# EasyEDA Pro project 4Layer_Artix7_DDR3_Core_Board.epro, board PCB1
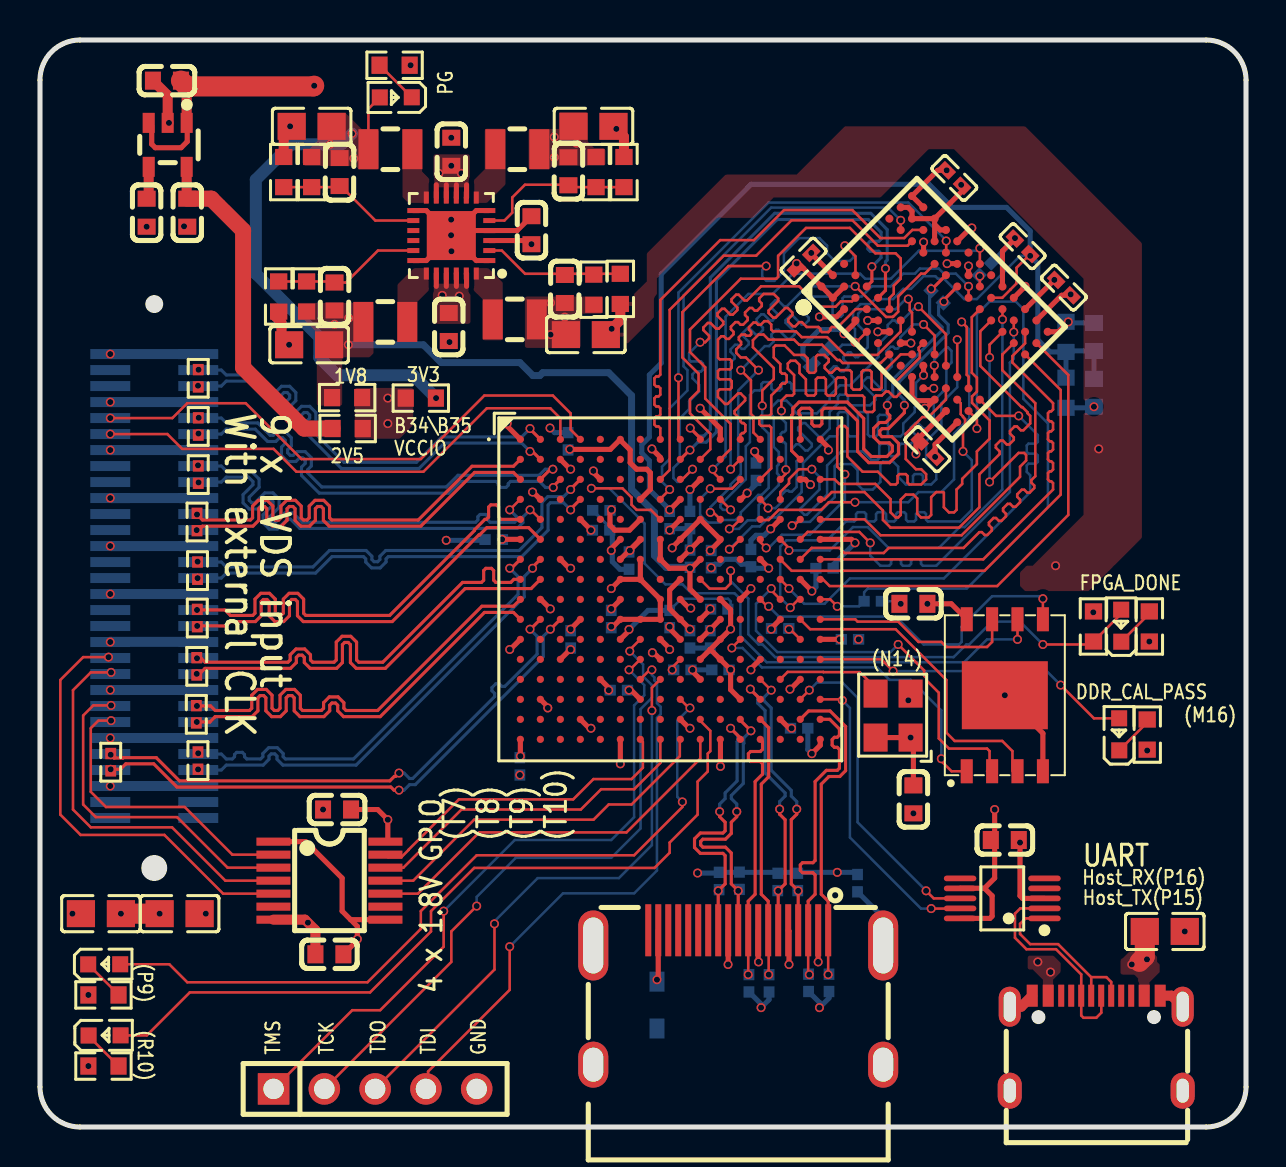
[diagram p2: board, top side]
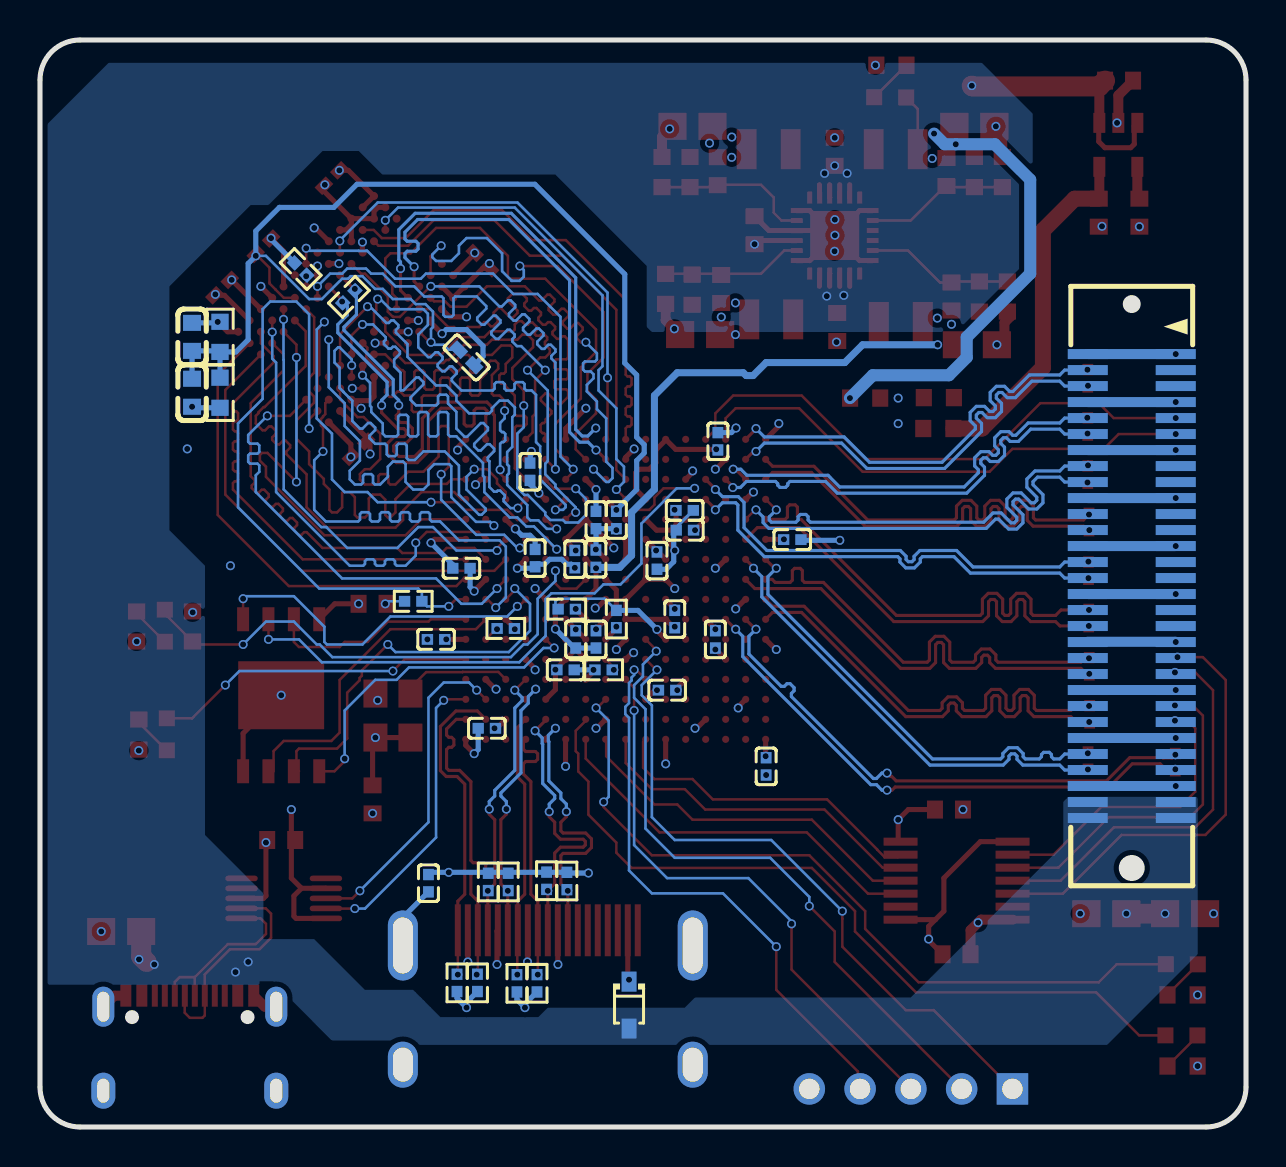
[diagram p3: board, bottom side, seen from below]

Outline 60.33 x 54.36 mm; copper layers: Top Layer, Inner1, Inner2, Bottom Layer. Coordinates in mm from the lower left corner of the outline.
Outline path: 0,52.36 0,2 arc(0.59,0.59) 2,0 58.33,0 arc(59.74,0.59) 60.33,2 60.33,52.36 arc(59.74,53.77) 58.33,54.36 2,54.36 arc(0.59,53.77) 0,52.36
Stack: Top Layer 0.035mm 外层铜厚1oz / Dielectric1 0.2104mm 7628 RC49% 8.6mil / Inner1 0.0152mm 内层铜厚 / Dielectric2 1.065mm 1.1mm H/HOZ Copper / Inner2 0.0152mm 内层铜厚 / Dielectric3 0.2104mm 7628 RC49% 8.6mil / Bottom Layer 0.035mm 外层铜厚1oz

## Design rules (mm)
net DDR_DQ2: DDR_DQ
net DDR_DQ0: DDR_DQ
net DDR_DM: DDR_DQ
net DDR_DQ3: DDR_DQ
net DDR_DQS_P: DDR_DQ, DP1
net DDR_DQ1: DDR_DQ
net DDR_DQS_N: DDR_DQ, DP1
net DDR_DQ4: DDR_DQ
net DDR_DQ5: DDR_DQ
net DDR_DQ7: DDR_DQ
net DDR_DQ6: DDR_DQ
net DDR_A8: DDR_CA
net DDR_A14: DDR_CA
net DDR_A13: DDR_CA
net DDR_A6: DDR_CA
net DDR_A11: DDR_CA
net DDR_A9: DDR_CA
net DDR_A7: DDR_CA
net DDR_A4: DDR_CA
net DDR_A1: DDR_CA
net DDR_A2: DDR_CA
net DDR_A5: DDR_CA
net DDR_BA1: DDR_CA
net DDR_A12: DDR_CA
net DDR_A0: DDR_CA
net DDR_A3: DDR_CA
net DDR_A15: DDR_CA
net DDR_BA2: DDR_CA
net DDR_BA0: DDR_CA
net DDR_A10: DDR_CA
net DDR_WE_N: DDR_CA
net DDR_CS_N: DDR_CA
net DDR_CKE: DDR_CA
net DDR_CK_N: DDR_CA, DP2
net DDR_CAS_N: DDR_CA
net DDR_ODT: DDR_CA
net DDR_CK_P: DDR_CA, DP2
net DDR_RAS_N: DDR_CA
net TMDS_D2_P: DP6
net TMDS_D2_N: DP6
net TMDS_D1_P: DP5
net TMDS_D1_N: DP5
net TMDS_D0_P: DP4
net TMDS_D0_N: DP4
net TMDS_CK_P: DP3
net TMDS_CK_N: DP3
net LVDS_CLK_N: LVDS, DP7
net LVDS_CLK_P: LVDS, DP7
net LVDS_D3_P: LVDS, DP8
net LVDS_D3_N: LVDS, DP8
net LVDS_D0_P: LVDS, DP9
net LVDS_D0_N: LVDS, DP9
net LVDS_D1_P: LVDS, DP10
net LVDS_D1_N: LVDS, DP10
net LVDS_D2_P: LVDS, DP11
net LVDS_D2_N: LVDS, DP11
net LVDS_D7_P: LVDS, DP13
net LVDS_D7_N: LVDS, DP13
net LVDS_D6_P: LVDS, DP14
net LVDS_D6_N: LVDS, DP14
net LVDS_D5_P: LVDS, DP15
net LVDS_D5_N: LVDS, DP15
net LVDS_D4_P: LVDS, DP12
net LVDS_D4_N: LVDS, DP12
net LVDS_D8_P: LVDS, DP16
net LVDS_D8_N: LVDS, DP16
template: 自定义配置
spacing copperThickness1oz (default): track to track 0.127, other pairs 0.127 to 0.3
spacing copperThickness2oz: track to track 0.203, other pairs 0.152 to 0.3
spacing copperThicknessInner0.5oz: track to track 0.089, other pairs 0.152 to 0.3
track width copperThickness1oz (default): min 0.102, default 0.127, max 2.54
track width copperThickness2oz: min 0.203, default 0.254, max 2.54
track width copperThickness0.5oz: min 0.089, default 0.254, max 2.54
differential pair differentialPair (default): width min 0.127, default 0.156, max 2.54; gap min 0.152, default 0.152
via viaSize (default): diameter min 0.3, default 0.45, max 10; hole min 0.2, default 0.305, max 6.3
net GND uses copperRegionGND

## Placement (name value [footprint] x y rotation side)
C1  100nF  [C0402]  44.39 33.89 135 top
C3  100nF  [C0402]  45.74 47.45 135 top
C4  100nF  [C0402]  38.19 43.32 45 top
C5  100nF  [C0402]  51.21 41.97 315 top
C7  100nF  [C0402]  49.15 44.04 315 top
C8  100nF  [C0402]  38.99 38.48 45 bottom
C9  470nF  [C0402-S]  39.24 27.94 180 bottom
C10  470nF  [C0402-S]  35.56 28.45 90 bottom
C11  470nF  [C0402-S]  31.5 30.35 90 bottom
C12  470nF  [C0402-S]  35.81 32.77 90 bottom
C13  470nF  [C0402-S]  32.51 30.35 90 bottom
C54  220pF  [C0603]  14.99 47.75 90 top
C55  220pF  [C0603]  26.43 47.79 270 top
C56  220pF  [C0603]  26.25 41.91 90 top
C57  220pF  [C0603]  14.73 41.53 270 top
C59  470nF  [C0402-S]  28.58 25.4 90 bottom
C60  470nF  [C0402-S]  29.46 28.32 90 bottom
C61  470nF  [C0402-S]  32.51 24.38 90 bottom
C62  470nF  [C0402-S]  33.57 28.4 90 bottom
C63  470nF  [C0402-S]  33.53 24.38 90 bottom
C64  470nF  [C0402-S]  32.52 28.42 270 bottom
C67  470nF  [C0402-S]  40.51 24.38 180 bottom
C68  470nF  [C0402-S]  37.97 19.94 180 bottom
C69  470nF  [C0402-S]  28.96 21.84 0 bottom
C70  470nF  [C0402-S]  34.04 22.86 180 bottom
C72  470nF  [C0402-S]  24 18.03 90 bottom
C74  470nF  [C0402-S]  26.54 24.38 270 bottom
C75  470nF  [C0402-S]  28.07 29.84 180 bottom
C76  470nF  [C0402-S]  26.42 34.29 270 bottom
C77  22uF  [C0805]  13.59 50.04 0 top
C78  22uF  [C0805]  27.69 50.04 0 top
C79  22uF  [C0805]  13.46 39.12 0 top
C80  22uF  [C0805]  27.31 39.62 0 top
C82  100nF  [C0603]  43.69 16.38 90 top
C83  100nF  [C0603]  43.69 26.16 0 top
C84  10uF  [C0603]  20.57 48.77 270 top
C85  10uF  [C0603]  20.45 40 90 top
C86  10uF  [C0603]  24.58 44.84 270 top
C87  470nF  [C0402-S]  28.08 30.84 0 bottom
C88  100nF  [C0603]  48.26 14.35 180 top
C89  10uF  [C0603]  5.33 45.72 90 top
C90  10uF  [C0603]  7.37 45.72 90 top
C91  10uF  [C0603]  6.35 52.32 0 top
C92  100nF  [C0603]  52.72 39.51 270 bottom
C93  100nF  [C0603]  52.72 36.72 270 bottom
C94  100nF  [C0603]  14.48 8.64 0 top
C95  100nF  [C0603]  14.86 15.88 0 top
C96  470nF  [C0402-S]  22.7 29.37 0 bottom
C97  22uF  [C0805]  3.05 10.67 0 top
C98  22uF  [C0805]  56.26 9.78 180 top
C99  22uF  [C0805]  6.98 10.67 180 top
C100  470nF  [C0402-S]  40.89 12.19 90 bottom
CN1  X0802WVS-60AS-LPV01  [CONN-SMD_60P-P0.80_XKB_X0802WVS-60ADS-LPV01]  5.72 27.05 270 bottom
D1  1N5819WS  [SOD-323_L1.8-W1.3-LS2.5-RD]  30.86 6.1 270 bottom
H1  -  [HDR-TH_5P-P2.54-V-F]  16.76 1.91 0 top
L1  1.5uH  [IND-SMD_L2.5-W2.0_YXMBL252010P]  17.53 48.89 180 top
L2  1.5uH  [IND-SMD_L2.5-W2.0_YXMBL252010P]  23.88 48.89 0 top
L3  1.5uH  [IND-SMD_L2.5-W2.0_YXMBL252010P]  23.75 40.39 180 top
L4  1.5uH  [IND-SMD_L2.5-W2.0_YXMBL252010P]  17.27 40.26 0 top
LED1  -  [LED_0603]  54.08 25.12 90 top
LED2  -  [LED_0603]  53.97 19.69 90 top
LED3  -  [LED_0603]  17.75 51.48 180 top
LED4  -  [LED_0603]  3.26 8.14 0 top
LED5  -  [LED_0603]  3.28 4.59 0 top
R1  240  [R0402]  47.28 42.9 225 bottom
R2  100  [R0402]  44.88 41.52 315 bottom
R3  NAN  [R0603]  27.81 47.75 270 top
R4  NAN  [R0603]  29.21 47.75 270 top
R5  NAN  [R0603]  27.7 41.87 90 top
R6  NAN  [R0603]  29.03 41.91 270 top
R7  NAN  [R0603]  13.34 41.53 270 top
R8  NAN  [R0603]  11.94 41.53 270 top
R9  NAN  [R0603]  13.59 47.75 90 top
R10  NAN  [R0603]  12.19 47.75 90 top
R11  0R  [R0603]  15.36 36.47 180 top
R12  NAN  [R0603]  15.39 34.93 180 top
R13  4.7K  [R0402]  33.98 25.89 0 bottom
R14  1K  [R0402]  32.13 22.86 0 bottom
R15  4.7K  [R0402]  31.5 25.4 90 bottom
R16  1K  [R0402]  37.02 24.93 0 bottom
R20  1K  [R0603]  52.69 25.03 90 top
R21  1K  [R0603]  55.49 25.03 90 top
R22  1K  [R0603]  55.38 19.62 90 top
R23  50R  [R0402]  37.9 12.25 270 bottom
R24  50R  [R0402]  36.91 12.25 270 bottom
R25  50R  [R0402]  34.99 12.31 270 bottom
R26  50R  [R0402]  33.97 12.3 270 bottom
R27  50R  [R0402]  39.47 7.21 90 bottom
R28  50R  [R0402]  38.44 7.21 90 bottom
R29  50R  [R0402]  36.47 7.19 90 bottom
R30  50R  [R0402]  35.46 7.19 90 bottom
R31  100R  [R0402]  3.54 18.24 270 top
R32  100R  [R0402]  7.82 20.64 90 top
R33  100R  [R0402]  7.84 23.04 90 top
R34  100R  [R0402]  7.9 18.32 90 top
R35  100R  [R0402]  7.87 25.45 90 top
R36  100R  [R0402]  7.88 27.82 90 top
R37  100R  [R0402]  7.92 32.62 90 top
R38  100R  [R0402]  7.85 30.25 90 top
R39  100R  [R0402]  7.92 37.44 90 top
R40  100R  [R0402]  7.92 35.03 90 top
R41  1K  [R0603]  51.32 36.72 270 bottom
R42  1K  [R0603]  51.32 39.51 270 bottom
R43  4.7K  [R0603]  17.74 53.09 180 top
R44  4.7K  [R0603]  3.17 6.6 0 top
R45  4.7K  [R0603]  3.17 3.05 0 top
R46  NAN  [R0603]  19.05 36.45 0 top
R47  4.7K  [R0402]  41.66 26.29 180 bottom
U1  XC7A35T-2FTG256I  [FTBGA-256_L17.0-W17.0-R16-C16-P1.00-TL]  31.53 26.89 0 top
U2  MT41K512M8DA-107 AIT:P  [FBGA-78_L10.5-W8.0-R13-C6-P0.80-TL]  44.75 40.9 45 top
U4  EA3059  [VQFN-24_L4.0-W4.0-P0.50-TL-EP2.5]  20.57 44.58 180 top
U5  W25Q128JVEIQ  [WSON-8_L6.0-W8.0-P1.27-BL-EP]  48.26 21.59 0 top
U6  CH340E  [MSOP-10_L3.0-W3.0-P0.50-LS5.0-BL]  48.13 11.43 90 top
U7  SPX3819M5-L-2-5/TR  [SOT-23-5_L2.9-W1.6-P0.95-LS2.8-BR]  6.39 49.11 90 top
U8  TXS0104EPWR  [TSSOP-14_L5.0-W4.4-P0.65-LS6.4-BL]  14.48 12.32 270 top
USB1  HDMI-001S  [HDMI-SMD_HDMI-001S]  34.93 6.48 0 top
USB2  TYPE-C 16PIN 2MD(073)  [USB-C-SMD_TYPE-C-6PIN-2MD-073]  52.83 4.19 0 top
X1  50MHz  [OSC-SMD_4P-L3.2-W2.5-BL]  42.67 20.57 90 top

## Footprints (pads in the part's own frame, mm; a bottom-side part is the same pattern mirrored in y, then rotated)
C0402
  rect 0.79x0.54 smd: 1(-0.545,0) 2(0.545,0)
C0402-S
  rect 0.566x0.54 smd: 1(-0.433,0) 2(0.433,0)
C0603
  rect 0.8x0.9 smd: 1(-0.7,0) 2(0.7,0)
C0805
  rect 1.41x1.35 smd: 1(-1,0) 2(1,0)
CONN-SMD_60P-P0.80_XKB_X0802WVS-60ADS-LPV01
  rect 0.5x2 smd: 1(-11.6,2.2) 2(-11.6,-2.2) 3(-10.8,2.2) 4(-10.8,-2.2) 5(-10,2.2) 6(-10,-2.2) 7(-9.2,2.2) 8(-9.2,-2.2) 9(-8.4,2.2) 10(-8.4,-2.2) 11(-7.6,2.2) 12(-7.6,-2.2) 13(-6.8,2.2) 14(-6.8,-2.2) 15(-6,2.2) 16(-6,-2.2) 17(-5.2,2.2) 18(-5.2,-2.2) 19(-4.4,2.2) 20(-4.4,-2.2) 21(-3.6,2.2) 22(-3.6,-2.2) 23(-2.8,2.2) 24(-2.8,-2.2) 25(-2,2.2) 26(-2,-2.2) 27(-1.2,2.2) 28(-1.2,-2.2) 29(-0.4,2.2) 30(-0.4,-2.2) 31(0.4,2.2) 32(0.4,-2.2) 33(1.2,2.2) 34(1.2,-2.2) 35(2,2.2) 36(2,-2.2) 37(2.8,2.2) 38(2.8,-2.2) 39(3.6,2.2) 40(3.6,-2.2) 41(4.4,2.2) 42(4.4,-2.2) 43(5.2,2.2) 44(5.2,-2.2) 45(6,2.2) 46(6,-2.2) 47(6.8,2.2) 48(6.8,-2.2) 49(7.6,2.2) 50(7.6,-2.2) 51(8.4,2.2) 52(8.4,-2.2) 53(9.2,2.2) 54(9.2,-2.2) 55(10,2.2) 56(10,-2.2) 57(10.8,2.2) 58(10.8,-2.2) 59(11.6,2.2) 60(11.6,-2.2)
FBGA-78_L10.5-W8.0-R13-C6-P0.80-TL
  round 0.4 smd: A1(-3.2,4.8) A2(-2.4,4.8) A3(-1.6,4.8) A7(1.6,4.8) A8(2.4,4.8) A9(3.2,4.8) B1(-3.2,4) B2(-2.4,4) B3(-1.6,4) B7(1.6,4) B8(2.4,4) B9(3.2,4) C1(-3.2,3.2) C2(-2.4,3.2) C3(-1.6,3.2) C7(1.6,3.2) C8(2.4,3.2) C9(3.2,3.2) D1(-3.2,2.4) D2(-2.4,2.4) D3(-1.6,2.4) D7(1.6,2.4) D8(2.4,2.4) D9(3.2,2.4) E1(-3.2,1.6) E2(-2.4,1.6) E3(-1.6,1.6) E7(1.6,1.6) E8(2.4,1.6) E9(3.2,1.6) F1(-3.2,0.8) F2(-2.4,0.8) F3(-1.6,0.8) F7(1.6,0.8) F8(2.4,0.8) F9(3.2,0.8) G1(-3.2,0) G2(-2.4,0) G3(-1.6,0) G7(1.6,0) G8(2.4,0) G9(3.2,0) H1(-3.2,-0.8) H2(-2.4,-0.8) H3(-1.6,-0.8) H7(1.6,-0.8) H8(2.4,-0.8) H9(3.2,-0.8) J1(-3.2,-1.6) J2(-2.4,-1.6) J3(-1.6,-1.6) J7(1.6,-1.6) J8(2.4,-1.6) J9(3.2,-1.6) K1(-3.2,-2.4) K2(-2.4,-2.4) K3(-1.6,-2.4) K7(1.6,-2.4) K8(2.4,-2.4) K9(3.2,-2.4) L1(-3.2,-3.2) L2(-2.4,-3.2) L3(-1.6,-3.2) L7(1.6,-3.2) L8(2.4,-3.2) L9(3.2,-3.2) M1(-3.2,-4) M2(-2.4,-4) M3(-1.6,-4) M7(1.6,-4) M8(2.4,-4) M9(3.2,-4) N1(-3.2,-4.8) N2(-2.4,-4.8) N3(-1.6,-4.8) N7(1.6,-4.8) N8(2.4,-4.8) N9(3.2,-4.8)
FTBGA-256_L17.0-W17.0-R16-C16-P1.00-TL
  round 0.36 smd: A1(-7.5,7.5) A2(-6.5,7.5) A3(-5.5,7.5) A4(-4.5,7.5) A5(-3.5,7.5) A6(-2.5,7.5) A7(-1.5,7.5) A8(-0.5,7.5) A9(0.5,7.5) A10(1.5,7.5) A11(2.5,7.5) A12(3.5,7.5) A13(4.5,7.5) A14(5.5,7.5) A15(6.5,7.5) A16(7.5,7.5) B1(-7.5,6.5) B2(-6.5,6.5) B3(-5.5,6.5) B4(-4.5,6.5) B5(-3.5,6.5) B6(-2.5,6.5) B7(-1.5,6.5) B8(-0.5,6.5) B9(0.5,6.5) B10(1.5,6.5) B11(2.5,6.5) B12(3.5,6.5) B13(4.5,6.5) B14(5.5,6.5) B15(6.5,6.5) B16(7.5,6.5) C1(-7.5,5.5) C2(-6.5,5.5) C3(-5.5,5.5) C4(-4.5,5.5) C5(-3.5,5.5) C6(-2.5,5.5) C7(-1.5,5.5) C8(-0.5,5.5) C9(0.5,5.5) C10(1.5,5.5) C11(2.5,5.5) C12(3.5,5.5) C13(4.5,5.5) C14(5.5,5.5) C15(6.5,5.5) C16(7.5,5.5) D1(-7.5,4.5) D2(-6.5,4.5) D3(-5.5,4.5) D4(-4.5,4.5) D5(-3.5,4.5) D6(-2.5,4.5) D7(-1.5,4.5) D8(-0.5,4.5) D9(0.5,4.5) D10(1.5,4.5) D11(2.5,4.5) D12(3.5,4.5) D13(4.5,4.5) D14(5.5,4.5) D15(6.5,4.5) D16(7.5,4.5) E1(-7.5,3.5) E2(-6.5,3.5) E3(-5.5,3.5) E4(-4.5,3.5) E5(-3.5,3.5) E6(-2.5,3.5) E7(-1.5,3.5) E8(-0.5,3.5) E9(0.5,3.5) E10(1.5,3.5) E11(2.5,3.5) E12(3.5,3.5) E13(4.5,3.5) E14(5.5,3.5) E15(6.5,3.5) E16(7.5,3.5) F1(-7.5,2.5) F2(-6.5,2.5) F3(-5.5,2.5) F4(-4.5,2.5) F5(-3.5,2.5) F6(-2.5,2.5) F7(-1.5,2.5) F8(-0.5,2.5) F9(0.5,2.5) F10(1.5,2.5) F11(2.5,2.5) F12(3.5,2.5) F13(4.5,2.5) F14(5.5,2.5) F15(6.5,2.5) F16(7.5,2.5) G1(-7.5,1.5) G2(-6.5,1.5) G3(-5.5,1.5) G4(-4.5,1.5) G5(-3.5,1.5) G6(-2.5,1.5) G7(-1.5,1.5) G8(-0.5,1.5) G9(0.5,1.5) G10(1.5,1.5) G11(2.5,1.5) G12(3.5,1.5) G13(4.5,1.5) G14(5.5,1.5) G15(6.5,1.5) G16(7.5,1.5) H1(-7.5,0.5) H2(-6.5,0.5) H3(-5.5,0.5) H4(-4.5,0.5) H5(-3.5,0.5) H6(-2.5,0.5) H7(-1.5,0.5) H8(-0.5,0.5) H9(0.5,0.5) H10(1.5,0.5) H11(2.5,0.5) H12(3.5,0.5) H13(4.5,0.5) H14(5.5,0.5) H15(6.5,0.5) H16(7.5,0.5) J1(-7.5,-0.5) J2(-6.5,-0.5) J3(-5.5,-0.5) J4(-4.5,-0.5) J5(-3.5,-0.5) J6(-2.5,-0.5) J7(-1.5,-0.5) J8(-0.5,-0.5) J9(0.5,-0.5) J10(1.5,-0.5) J11(2.5,-0.5) J12(3.5,-0.5) J13(4.5,-0.5) J14(5.5,-0.5) J15(6.5,-0.5) J16(7.5,-0.5) K1(-7.5,-1.5) K2(-6.5,-1.5) K3(-5.5,-1.5) K4(-4.5,-1.5) K5(-3.5,-1.5) K6(-2.5,-1.5) K7(-1.5,-1.5) K8(-0.5,-1.5) K9(0.5,-1.5) K10(1.5,-1.5) K11(2.5,-1.5) K12(3.5,-1.5) K13(4.5,-1.5) K14(5.5,-1.5) K15(6.5,-1.5) K16(7.5,-1.5) L1(-7.5,-2.5) L2(-6.5,-2.5) L3(-5.5,-2.5) L4(-4.5,-2.5) L5(-3.5,-2.5) L6(-2.5,-2.5) L7(-1.5,-2.5) L8(-0.5,-2.5) L9(0.5,-2.5) L10(1.5,-2.5) L11(2.5,-2.5) L12(3.5,-2.5) L13(4.5,-2.5) L14(5.5,-2.5) L15(6.5,-2.5) L16(7.5,-2.5) M1(-7.5,-3.5) M2(-6.5,-3.5) M3(-5.5,-3.5) M4(-4.5,-3.5) M5(-3.5,-3.5) M6(-2.5,-3.5) M7(-1.5,-3.5) M8(-0.5,-3.5) M9(0.5,-3.5) M10(1.5,-3.5) M11(2.5,-3.5) M12(3.5,-3.5) M13(4.5,-3.5) M14(5.5,-3.5) M15(6.5,-3.5) M16(7.5,-3.5) N1(-7.5,-4.5) N2(-6.5,-4.5) N3(-5.5,-4.5) N4(-4.5,-4.5) N5(-3.5,-4.5) N6(-2.5,-4.5) N7(-1.5,-4.5) N8(-0.5,-4.5) N9(0.5,-4.5) N10(1.5,-4.5) N11(2.5,-4.5) N12(3.5,-4.5) N13(4.5,-4.5) N14(5.5,-4.5) N15(6.5,-4.5) N16(7.5,-4.5) P1(-7.5,-5.5) P2(-6.5,-5.5) P3(-5.5,-5.5) P4(-4.5,-5.5) P5(-3.5,-5.5) P6(-2.5,-5.5) P7(-1.5,-5.5) P8(-0.5,-5.5) P9(0.5,-5.5) P10(1.5,-5.5) P11(2.5,-5.5) P12(3.5,-5.5) P13(4.5,-5.5) P14(5.5,-5.5) P15(6.5,-5.5) P16(7.5,-5.5) R1(-7.5,-6.5) R2(-6.5,-6.5) R3(-5.5,-6.5) R4(-4.5,-6.5) R5(-3.5,-6.5) R6(-2.5,-6.5) R7(-1.5,-6.5) R8(-0.5,-6.5) R9(0.5,-6.5) R10(1.5,-6.5) R11(2.5,-6.5) R12(3.5,-6.5) R13(4.5,-6.5) R14(5.5,-6.5) R15(6.5,-6.5) R16(7.5,-6.5) T1(-7.5,-7.5) T2(-6.5,-7.5) T3(-5.5,-7.5) T4(-4.5,-7.5) T5(-3.5,-7.5) T6(-2.5,-7.5) T7(-1.5,-7.5) T8(-0.5,-7.5) T9(0.5,-7.5) T10(1.5,-7.5) T11(2.5,-7.5) T12(3.5,-7.5) T13(4.5,-7.5) T14(5.5,-7.5) T15(6.5,-7.5) T16(7.5,-7.5)
HDMI-SMD_HDMI-001S
  rect 0.3x2.6 smd: 1(4.5,3.36) 2(4,3.36) 3(3.5,3.36) 4(3,3.36) 5(2.5,3.36) 6(2,3.36) 7(1.5,3.36) 8(1,3.36) 9(0.5,3.36) 10(0,3.36) 11(-0.5,3.36) 12(-1,3.36) 13(-1.5,3.36) 14(-2,3.36) 15(-2.5,3.36) 16(-3,3.36) 17(-3.5,3.36) 18(-4,3.36) 19(-4.5,3.36)
  oval 1.5x3.5 hole 1x2.8: 20(-7.25,2.6) 21(7.25,2.6)
  oval 1.5x2.3 hole 1x1.7: 22(-7.25,-3.36) 23(7.25,-3.36)
HDR-TH_5P-P2.54-V-F
  rect 1.575x1.575 hole 1.02: 1(-5.08,0)
  round 1.575 hole 1.02: 2(-2.54,0) 3(0,0) 4(2.54,0) 5(5.08,0)
IND-SMD_L2.5-W2.0_YXMBL252010P
  rect 1x2 smd: 1(1.1,0) 2(-1.1,0)
LED_0603
  rect 0.8x0.8 smd: 1(-0.851,-0.01) 2(0.75,-0.005)
MSOP-10_L3.0-W3.0-P0.50-LS5.0-BL
  oval 0.28x1.62 smd: 1(-1,-2.11) 2(-0.5,-2.11) 3(0,-2.11) 4(0.5,-2.11) 5(1,-2.11) 6(1,2.11) 7(0.5,2.11) 8(0,2.11) 9(-0.5,2.11) 10(-1,2.11)
OSC-SMD_4P-L3.2-W2.5-BL
  rect 1.4x1.2 smd: 1(-1.1,-0.875) 2(1.1,-0.875) 3(1.1,0.875) 4(-1.1,0.875)
R0402
  rect 0.566x0.54 smd: 1(-0.433,0) 2(0.433,0)
R0603
  rect 0.806x0.864 smd: 1(-0.753,0) 2(0.753,0)
SOD-323_L1.8-W1.3-LS2.5-RD
  rect 1x0.75 smd: 1(-1.173,0) 2(1.173,0)
SOT-23-5_L2.9-W1.6-P0.95-LS2.8-BR
  rect 1x0.6 smd: 1(1.1,-0.95) 2(1.1,0) 3(1.1,0.95) 4(-1.1,0.95) 5(-1.1,-0.95)
TSSOP-14_L5.0-W4.4-P0.65-LS6.4-BL
  rect 0.4x1.7 smd: 1(-1.95,-2.8) 2(-1.3,-2.8) 3(-0.65,-2.8) 4(0,-2.8) 5(0.65,-2.8) 6(1.3,-2.8) 7(1.95,-2.8) 8(1.95,2.8) 9(1.3,2.8) 10(0.65,2.8) 11(0,2.8) 12(-0.65,2.8) 13(-1.3,2.8) 14(-1.95,2.8)
USB-C-SMD_TYPE-C-6PIN-2MD-073
  rect 0.55x1.1 smd: 1(-3.2,2.375) 2(-2.4,2.375) 11(2.4,2.375) 12(3.2,2.375)
  rect 0.3x1.1 smd: 3(-1.75,2.375) 4(-1.25,2.375) 5(-0.75,2.375) 6(-0.25,2.375) 7(0.25,2.375) 8(0.75,2.375) 9(1.25,2.375) 10(1.75,2.375)
  oval 1.1x2 hole 0.6x1.5: 13(-4.325,1.825) 14(4.325,1.825)
  oval 1.2x1.8 hole 0.6x1.2: 13(-4.325,-2.375) 14(4.325,-2.375)
VQFN-24_L4.0-W4.0-P0.50-TL-EP2.5
  rect 0.6x0.25 smd: 1(-1.9,1.25) 2(-1.9,0.75) 3(-1.9,0.25) 4(-1.9,-0.25) 5(-1.9,-0.75) 6(-1.9,-1.25) 13(1.9,-1.25) 14(1.9,-0.75) 15(1.9,-0.25) 16(1.9,0.25) 17(1.9,0.75) 18(1.9,1.25)
  rect 0.25x0.6 smd: 7(-1.25,-1.9) 8(-0.75,-1.9) 9(-0.25,-1.9) 10(0.249,-1.9) 11(0.75,-1.9) 12(1.25,-1.9) 19(1.25,1.9) 20(0.75,1.9) 21(0.249,1.9) 22(-0.25,1.9) 23(-0.75,1.9) 24(-1.25,1.9)
  rect 2.45x2.45 smd: 25(0,0)
WSON-8_L6.0-W8.0-P1.27-BL-EP
  rect 0.6x1.2 smd: 1(-1.905,-3.8) 2(-0.635,-3.8) 3(0.635,-3.8) 4(1.905,-3.8) 5(1.905,3.8) 6(0.635,3.8) 7(-0.635,3.8) 8(-1.905,3.8)
  rect 4.3x3.4 smd: 9(0.001,0.001)

## Nets
As in the schematic.

Pads without a net: CN1 3 5 15 17 21 23 27 29 33 35; U1 A5 A7 A14 B4 B5 B6 B7 B14 B16 C6 C7 D3 D5 D6 D10 D15 E3 E5 E6 F3 F4 F5 G4 G5 G11 G12 H3 H4 H5 H8 H11 H12 H13 J3 J4 J5 J7 K5 K12 K13 L2 L3 L4 L5 L13 L14 M1 M2 M4 M5 M6 M12 M14 M15 N1 N2 N3 N4 N6 N9 N11 N12 N16 P1 P3 P4 P5 P6 P8 P10 P11 P14 R1 R2 R3 R5 R6 R7 R8 R11 T2 T3 T4 T5 T14 T15; U2 A3 A7 F1 F9 H1 H9; U4 15 16; U6 4 5 6; U8 6 9; USB1 13 14 15 16 17 19; USB2 3 4 9 10

## Via types
v1: diameter 0.45, hole 0.305, Top Layer to Bottom Layer, 314 vias

## Routing (per net, layer and track width the routed paths; a pad name or vN(x,y) marks a point on that pad's centre or on a via; arc(x,y) is an arc through that point)
+1V0: length 17.4
  Top Layer w0.254: U1.G6 U1.F7 30.03,29.35 v1(29.51,28.83) ; U1.H9 31.5,26.85 31.5,25.91 32.02,25.39 U1.K9 32.51,24.9 v1(32.51,24.89) ; v1(31.5,23.88) 31.5,23.92 U1.L8 ; v1(28.58,25.91) 29.03,26.36 U1.J6 ; v1(33.53,28.83) 34.03,29.33 U1.F11 U1.E10 U1.F9 31.62,28.98 v1(31.62,28.96)
  Inner2 w0.254: 30.99,30.35 32,30.35 v1(33.53,28.83)
  Inner2 w0.4: v1(31.5,23.88) 31.88,23.88 32.51,24.51 v1(32.51,24.89) 31.34,26.07 31.33,26.07
  vias: v1(25.54,41.21) v1(25.54,39.62) v1(26.25,40.5)
+1V5: length 25.9
  Top Layer w0.127: U2.K1 v1(44.7,36.94)
  Top Layer w0.254: 44,34.5 44,34.28 ; 44,34.5 45.31,35.81 ; 44,34.5 43.81,34.31 v1(43.81,33.66) ; U1.J12 35.56,26.92 v1(35.56,26.92) ; U1.B13 35.75,33.67 v1(35.75,33.78) ; U2.C1 39.84,40.51 v1(38.99,40.51) ; U2.D7 44.2,43.74 v1(44.2,44.25) ; v1(46.61,44.96) 46.55,44.96 U2.E9 ; U2.M9 51.1,41.59 C5.2 ; v1(38.58,43.71) 38.58,43.67 U2.A2 ; U1.H15 38.61,26.81 v1(38.61,26.8) ; U1.C10 32.52,31.88 v1(32.51,31.88) ; U2.G2 v1(43.56,39.2) ; U2.G8 v1(46.45,43.05) ; v1(36.55,29.91) 36.55,29.91 U1.E14 ; U2.K9 49.28,42.03 v1(49.28,42.04) ; U2.E2 v1(41.4,40.33) ; U1.A16 39.44,33.98 v1(39.44,33.85) ; 44.18,45.99 43.62,46.55 44.9,47.84 v1(45.35,47.84)
  Bottom Layer w0.254: R41.2 52.66,35.96 v1(52.72,36.02) ; C10.2 35.56,29.34 35.81,29.59 36.23,29.59 v1(36.55,29.91) ; C9.2 38.81,27 v1(38.61,26.8) ; v1(32.51,31.88) C13.2 ; 35.8,33.14 35.8,33.67 35.73,33.74
  vias: v1(25.72,49.5) v1(25.73,48.49) v1(26.84,49.2) v1(51.55,41.64)
+1V8: length 106.7
  Top Layer w0.254: 15.54,10.37 15.88,10.03 v1(15.88,9.4) 15.88,9.33 C94.2 ; 15.54,10.37 15.11,10.8 15.11,12.45 13.29,14.27 U8.1 ; 15.54,10.37 U8.8 ; U1.K11 v1(33.53,24.88) U1.L10 ; U1.G10 32.58,27.94 v1(32.51,27.94) ; v1(32.51,27.94) 32.51,26.9 U1.J10 ; v1(32.51,27.94) 31.47,27.94 U1.G8 U1.F8
  Inner2 w0.35: v1(33.53,24.88) 34.29,25.65 34.29,26.29 32.64,27.94 v1(32.51,27.94)
  Inner2 w0.5: v1(15.44,40.45) 15.12,40.13 11.68,40.13 8.64,43.18 3.56,43.18 1.4,41.02 1.4,13.84 3.81,11.43 9.53,11.43 11.56,9.4 v1(15.88,9.4)
  Bottom Layer w0.35: v1(15.43,39.12) 19.18,39.12 20.07,38.23 24,38.23 24.65,37.58 25,37.58 25.15,37.72 28.45,37.72 29.59,36.58 29.59,31.88 30.73,30.73 30.73,28.58 31.32,27.99 C64.2
  vias: v1(14.73,40.14)
+2V5: length 17.7
  Top Layer w0.5: C90.2 7.34,46.45 U7.5
  Top Layer w0.8: 14.64,34.93 13.21,34.93 10.16,37.97 10.16,44.83 8.57,46.42 C90.2
+3V3: length 97.5
  Top Layer w0.127: 17,51.49 16.43,50.91 L1.1
  Top Layer w0.254: U1.P7 29.57,21.84 v1(29.46,21.84) ; U1.E7 29.49,29.84 28.75,29.84 28.51,30.09 28.51,30.79 v1(28.58,30.87) ; 47.24,11.94 46.03,11.94 U6.7 ; 47.24,11.94 47.75,12.45 v1(47.75,15.88) ; 47.24,11.94 47.62,11.56 47.62,10.54 47.51,10.43 U6.10 ; v1(32.64,22.86) 32.64,22.78 U1.N10 ; U1.T11 34.04,19.38 v1(34.04,18.03) ; C82.2 43.69,19.33 v1(43.55,19.47) X1.4 ; 46.35,25.39 45.58,26.16 v1(44.39,26.16) ; C95.2 16.89,15.88 v1(17.4,15.37) 17.4,14.39 U8.14 ; U1.L16 v1(40,24.39) ; v1(35.56,22.86) 35.56,22.92 U1.M13 ; v1(29.46,24.88) 29.46,24.82 U1.L6 ; U1.R14 37.47,19.94 v1(37.59,19.94)
  Inner2 w0.35: v1(28.58,30.87) 28.58,29.85 27.94,29.21 27.94,26.92 27.69,26.67 27.69,24.89 28.86,23.72 ; v1(32.64,22.86) 32.64,22.61 31.88,21.84 v1(29.46,21.84) 28.86,22.45 28.86,23.72 ; 28.86,23.72 28.86,24.27 v1(29.46,24.88)
  Inner2 w0.5: 27.18,13.08 26.42,13.84 18.92,13.84 v1(17.4,15.37)
  Bottom Layer w0.127: R13.2 34.54,26.03 34.54,26.29 34.42,26.42 32.08,26.42 R15.2
  Bottom Layer w0.254: C100.2 40.78,12.73 v1(39.88,12.73) 33.97,12.73 33.94,12.7 v1(32.89,12.7) ; R27.1 39.47,6.45 v1(38.99,5.97) 38.99,6.23 38.44,6.77 ; v1(32.64,22.86) C70.2 ; v1(29.46,24.88) 30.41,25.83 R15.2 ; 36.47,6.75 36.47,6.37 v1(36.07,5.97) 36.07,6.15 R30.1
  Bottom Layer w0.6: v1(15.61,49.67) 15.07,49.14 v1(14.52,49.14) 12.57,49.14 10.8,47.37 10.8,42.67 13.97,39.5 13.97,38.48 14.86,37.59 18.67,37.59 v1(19.81,36.45)
  vias: v1(15.7,48.43) v1(52.69,25.74)
GND: length 176.1
  Top Layer w0.254: v1(38.54,32.12) 38.28,32.39 U1.C15 ; U1.L1 23.52,23.88 v1(23.5,23.88) ; 44.7,36.32 44.32,35.94 v1(44.26,35.94) ; 44.7,36.32 U2.L1 ; 44.7,36.32 43.81,36.32 43.62,36.52 U2.J1 ; U6.3 49.15,11.43 49.02,11.56 v1(49.02,14.22) ; USB1.2 v1(38.93,8.25) ; 44.75,45.14 U2.D8 ; 44.75,45.14 U2.C9 ; 44.75,45.14 45.03,44.86 U2.D9 ; U1.K4 26.54,24.9 v1(26.54,24.89) ; 38.18,42.94 C4.1 ; 38.18,42.94 37.94,43.18 v1(37.85,43.18) ; 38.18,42.94 U2.A1 U2.B1 U2.B2 ; U1.J9 32.47,25.95 v1(32.55,25.95) ; 29.04,27.39 U1.H6 ; 29.04,27.39 v1(28.58,26.92) ; 29.04,27.39 U1.H7 ; U1.F6 28.58,28.93 v1(28.58,28.83) ; v1(44.78,33.51) 44.78,34.14 U2.N1 ; USB1.8 35.93,8.27 v1(35.94,8.25) ; USB1.11 34.43,8.14 v1(34.42,8.13) ; U1.H7 U1.J8 U1.K8 U1.K7 U1.K6 28.66,25.02 v1(28.58,25.02) ; U1.H7 U1.G7 ; U1.E9 31.5,29.85 v1(31.5,29.84) ; v1(48.26,21.59) 50.16,19.69 U5.4 ; v1(40.77,29.21) 40.59,29.39 U1.F16 ; U2.C9 U2.B8 43.62,45.79 43.42,45.99 U2.A8 ; U2.C9 46.12,46.8 C3.1 ; v1(38.61,18.67) 39.03,19.09 U1.T16 ; v1(32.51,19.94) 32.48,19.94 U1.R9 ; U1.D2 24.66,31.75 v1(24.64,31.75) ; v1(28.45,21.84) 28.45,21.97 U1.N5 ; 50.41,39.77 50.94,39.77 v1(51.44,40.26) ; v1(37.47,8.13) 37.47,9.8 USB1.5 ; U4.25 19.32,45.83 U4.13 ; U4.25 20.82,44.83 ; U4.25 19.32,43.33 U4.18 ; U4.25 21.82,43.33 U4.1 ; v1(35.37,31.7) 35.06,31.39 U1.D12 ; v1(36.45,27.94) 36.45,27.96 U1.G13 ; U1.G3 26.47,27.94 v1(26.54,27.94) ; v1(45.37,43.17) 45.87,43.17 U2.F8 ; 50.83,42.36 v1(50.74,42.36) U2.L9 ; U1.A1 23.37,35.05 v1(23.37,35.18) ; 20.82,44.83 U4.4 23.87,44.83 C86.1 ; 20.82,44.83 21.82,45.83 U4.6 ; v1(27.68,32.81) 27.68,32.73 U1.C5 ; U1.K14 36.58,24.93 v1(36.58,24.89) ; v1(25.4,20.95) 25.4,21.01 U1.P2 ; U1.N15 37.53,21.89 v1(37.51,21.89) ; U1.F10 v1(32.52,28.88) U1.G9 ; U2.J9 48.14,43.8 C7.1 ; U1.M8 30.7,23.72 v1(30.63,23.72) ; 42.49,39.77 v1(41.91,39.77) ; U1.P12 34.54,21.87 v1(34.54,22.87) U1.M11 33.54,23.88 33.53,23.88 33.53,23.89 U1.L11 v1(34.54,24.9) 34.54,25.87 U1.J11 ; 40.79,40.33 40.79,40.24 v1(40.21,39.67) ; U1.T6 v1(29.03,18.16) ; v1(30.61,33.91) 31.03,33.49 U1.B8 ; U1.M10 33.52,23.88 ; U1.A11 34.03,34.93 v1(33.02,35.94)
  Top Layer w0.5: v1(12.46,39.12) 12.08,39.5 12.08,40.23 11.78,40.53 11.78,40.91 ; R4.1 29.21,49.51 C78.2 ; R10.2 12.19,49.64 C77.1 ; C91.1 6.39,51.59 U7.2 ; C94.1 13.78,9.84 13.25,10.37 U8.7 ; C80.2 v1(28.59,39.91) 29.03,40.35 R6.2 ; 48.51,6.02 49.08,6.02 USB2.1 ; 57.16,6.02 56.61,6.57 USB2.12
  Bottom Layer w0.127: R47.1 42.93,26.29 v1(43.05,26.16)
  Bottom Layer w0.156: C87.1 28.5,29.98 C75.1
  Bottom Layer w0.254: C92.1 51.48,40.21 v1(51.44,40.26) ; 28.63,28.83 28.63,28.27 29.01,27.89 C60.1 ; 28.63,28.83 v1(28.58,28.83) ; 28.63,28.83 28.63,29.72 C75.1 ; C100.1 42.18,10.48 USB1.21 ; v1(35.37,31.7) 35.81,32.14 C12.1 ; C96.1 22.23,29.34 v1(20.32,29.34) ; v1(36.45,27.94) 35.63,27.94 C10.1 35.43,28.14 35.08,28.14 34.84,28.39 34.23,28.39 33.98,28.14 33.75,28.14 v1(33.57,27.96) ; v1(31.5,29.84) 31.57,29.92 C13.1 32.51,28.86 C64.1 ; C8.1 38.16,38.54 38.16,39.05 38.99,39.88 40,39.88 v1(40.21,39.67) ; C9.1 39.68,28.12 v1(40.77,29.21) ; R1.1 48.77,44.39 v1(48.77,44.45) ; C68.1 38.41,18.87 v1(38.61,18.67) ; C76.1 25.74,34.72 v1(25.51,34.95) ; C61.1 C63.1 33.59,23.95 v1(34.54,24.9)
  Bottom Layer w0.5: CN1.26 v1(3.52,29.05) ; CN1.32 v1(3.52,26.65) ; CN1.50 v1(3.52,19.45) ; 7.94,24.26 3.53,24.26 v1(3.52,24.25) ; v1(3.52,38.65) CN1.2 ; v1(3.52,17.05) CN1.56 ; CN1.44 v1(3.52,21.85) ; v1(3.52,33.85) CN1.14 ; v1(3.52,31.45) CN1.20 ; CN1.8 v1(3.52,36.25)
  vias: v1(1.62,10.67) v1(2.42,6.6) v1(2.42,3.05) v1(5.33,45.02) v1(6.45,50.21) v1(7.2,45.04) v1(8.29,10.67) v1(12.51,50.04) v1(13.4,10.22) v1(14.16,15.88) v1(18.54,53.09) v1(20.48,39.25) v1(20.57,49.47) v1(20.57,45.37) v1(20.56,44.59) v1(20.58,43.79) v1(24,17.6) v1(28.83,49.91) v1(40.95,24.38) v1(43.43,21.34) v1(43.69,15.68) v1(46.08,47.11) v1(50.8,28.07) v1(52.96,33.91) v1(55.38,18.82) v1(55.49,24.28) v1(57.26,9.78)
VCC: length 23.6
  Top Layer w0.254: U4.3 24.4,44.33 v1(24.58,44.14) ; U4.22 20.83,42.67 20.83,42.04 ; U4.10 20.32,47.12 ; U4.21 20.32,42.04 ; 20.83,47.12 20.83,46.48 U4.9 ; U4.20 19.82,42.04 ; 21.34,47.12 21.34,46.49 U4.8 ; U7.3 5.59,50.06 5.59,49.15 5.77,48.97 7.06,48.97 7.37,49.28 7.37,50.18 7.34,50.21 ; 21.34,42.04 21.34,42.66 U4.23 ; U4.11 19.82,47.12
  Top Layer w0.5: 7.34,50.21 7.34,52.04
  Top Layer w1: C98.2 55.26,8.52 54.99,8.25 ; C91.2 7.34,52.04 13.68,52.04 v1(13.72,52.07) ; v1(5.98,10.67) v1(4.05,10.67)
  vias: v1(19.95,47.69) v1(20.12,41.59) v1(20.57,48.07) v1(20.97,41.55) v1(21.08,47.69) v1(49.91,8.25) v1(50.55,7.75) v1(54.61,8.13) v1(55.37,8.38)
VCCIO_34_35: length 12.2
  Top Layer w0.254: v1(27.56,29.84) 27.56,29.85 U1.E4 ; v1(26.54,32.89) 26.52,32.89 U1.B3 ; v1(27.56,19.94) 27.48,19.94 U1.R4 ; U1.T1 v1(24.03,18.54) ; U1.F1 v1(23.11,29.39) ; v1(26.5,33.89) 26.51,33.88 28.53,33.88 U1.A6 29.03,34.34 29.52,33.85 29.52,33.22 29.84,32.89 30.35,32.89 30.53,32.71 30.53,31.89 U1.D7 ; U1.M3 26.52,23.88 v1(26.54,23.88) ; v1(25.53,25.91) 25.05,26.39 U1.J2
  vias: v1(17.4,36.45) v1(17.4,35.17)
CH340_DN: length 10.9
  Top Layer w0.127: U6.2 49.03,10.93 48.77,10.67 48.77,9.46 49.34,8.89 50.82,8.89 52.08,7.63 USB2.5 52.08,5.58 52.2,5.46 52.83,5.46 53.09,5.71 53.09,6.56 USB2.7
CH340_DP: length 9
  Top Layer w0.127: 52.58,7.49 50.93,9.14 49.53,9.14 49.02,9.65 49.02,10.16 49.29,10.43 U6.1 ; 52.58,7.49 USB2.6 ; 52.58,7.49 52.59,7.49 53.34,7.49 53.58,7.25 USB2.8
CH340_RXD: length 15.1
  Top Layer w0.127: U6.9 46.02,10.92 v1(44.58,10.92) ; v1(40.13,21.34) 40.08,21.39 U1.P16
  Bottom Layer w0.127: v1(44.58,10.92) 44.07,10.92 40.51,14.48 40.51,20.95 v1(40.13,21.34)
CH340_TXD: length 16.5
  Top Layer w0.127: U1.P15 38.03,21.39 v1(38.48,21.84) ; U6.8 44.7,11.43 v1(44.32,11.81)
  Bottom Layer w0.127: v1(44.32,11.81) 40.89,15.24 40.89,21.46 40.13,22.22 38.86,22.22 v1(38.48,21.84)
DDR_A0: length 23.2
  Top Layer w0.127: v1(43.94,41.02) 45.31,39.65 U2.K3 ; v1(34.48,29.91) 34.55,29.91 U1.E12
  Bottom Layer w0.127: v1(34.48,29.91) 34.97,29.91 35.4,30.34 35.8,30.34 35.95,30.49 35.95,31.1 36.96,32.11 36.96,32.6 36.87,32.69 36.87,33.05 36.96,33.14 36.96,33.75 36.7,34.01 36.7,35.49 36.58,35.62 36.58,35.98 ; 36.58,35.98 36.92,36.32 37.34,36.32 37.72,35.94 37.72,35.81 37.85,35.69 38.86,35.69 39.5,36.32 39.5,36.58 40,37.08 40.51,37.08 41.94,38.51 41.94,39.15 42.52,39.73 42.52,39.86 42.4,39.98 42.4,40.1 42.63,40.33 42.76,40.33 42.88,40.21 43,40.21 43.81,41.02 v1(43.94,41.02) ; 36.58,35.98 36.56,35.97
DDR_A1: length 23
  Top Layer w0.127: U1.E16 41.24,30.39 42.04,29.59 46.1,29.59 49.02,32.51 49.02,33.02 49.33,33.32 49.33,33.6 49.22,33.71 48.95,33.71 v1(47.5,32.26) ; v1(47.5,38.48) 47.5,39.12 48.14,39.77
  Bottom Layer w0.127: v1(47.5,38.48) v1(47.5,32.26)
DDR_A2: length 23.4
  Top Layer w0.127: v1(37.62,30.07) 37.71,30.07 U1.E15 ; U2.L3 v1(45.88,39.37)
  Bottom Layer w0.127: v1(37.62,30.07) 37.81,30.26 38.52,30.26 39.75,31.5 39.75,33.05 39.85,33.15 40.6,33.15 40.89,32.86 40.89,32.13 41.15,31.88 41.66,31.88 42.04,32.26 42.04,33.15 42.16,33.27 42.67,33.27 42.93,33.02 42.93,32.51 43.31,32.13 43.58,32.13 43.67,32.22 43.67,32.56 43.76,32.65 44.08,32.65 44.17,32.56 44.17,32.22 44.26,32.13 44.58,32.13 44.83,32.38 44.83,32.82 44.32,33.32 44.32,34.29 45.09,35.05 45.09,36.19 45.88,36.99 v1(45.88,39.37)
DDR_A3: length 23.4
  Top Layer w0.127: v1(44.74,38.08) 44.74,37.52 U2.K2 ; U1.D14 37.03,31.75 37.46,32.18 37.47,32.18 37.47,32.4 37.96,32.89 v1(38.61,32.89)
  Bottom Layer w0.127: v1(44.74,38.08) 44.74,38.38 45.34,38.99 45.41,38.99 45.59,38.81 45.59,38.23 45.34,37.97 45.34,36.96 45.14,36.76 45.14,36.75 44.89,36.5 44.88,36.5 44.7,36.32 44.7,35.31 44.32,34.92 44.19,34.92 43.91,35.2 43.79,35.2 43.56,34.98 43.56,34.85 43.84,34.57 43.84,34.44 43.56,34.16 43.07,34.16 42.98,34.07 42.98,33.64 42.89,33.55 42.57,33.55 42.48,33.64 42.48,34.07 42.39,34.16 42.07,34.16 41.98,34.07 41.98,33.45 41.89,33.36 41.57,33.36 41.14,33.78 40.08,33.78 39.37,33.08 39.37,31.62 38.36,30.61 38.23,30.61 38.04,30.81 38.04,30.92 38.99,31.88 38.99,32.51 v1(38.61,32.89)
DDR_A4: length 22.8
  Top Layer w0.127: U1.F15 38.4,29.76 40.98,29.76 v1(41.53,29.21) ; U2.L8 v1(48.71,39.75)
  Bottom Layer w0.127: v1(48.71,39.75) 48.71,38.42 48.51,38.23 48.51,31.75 44.83,28.07 44.16,28.07 44.07,28.16 44.07,28.3 43.98,28.39 43.66,28.39 43.57,28.3 43.57,28.16 43.48,28.07 43.16,28.07 43.07,28.16 43.07,28.3 42.98,28.39 42.66,28.39 42.57,28.3 42.57,28.16 42.48,28.07 42.04,28.07 41.53,28.58 v1(41.53,29.21)
DDR_A5: length 22.8
  Top Layer w0.127: v1(40.26,32.64) 39.88,33.02 39.88,34.92 40,35.05 40.26,35.05 40.39,34.92 40.39,33.53 41.15,32.77 41.91,32.77 42.55,32.13 42.81,32.13 42.9,32.22 42.9,32.56 42.99,32.65 43.31,32.65 43.4,32.56 43.4,32.22 43.49,32.13 44.08,32.13 44.32,32.37 44.32,32.65 44.08,32.89 43.81,32.89 43.31,33.4 43.31,34.67 44.14,35.5 44.45,35.5 45.31,36.37 U2.L2 ; v1(36.32,28.96) 36.03,29.25 U1.F13
  Bottom Layer w0.127: v1(40.26,32.64) 40.26,31.37 38.5,29.61 37.1,29.61 36.45,28.96 v1(36.32,28.96)
DDR_A6: length 23.3
  Top Layer w0.127: U1.G16 47.18,28.39 50.67,31.88 50.67,32.2 50.58,32.29 50.51,32.29 50.42,32.38 50.42,32.7 50.51,32.79 50.58,32.79 50.67,32.88 50.67,33.2 50.58,33.29 50.51,33.29 50.42,33.38 50.42,33.7 50.51,33.79 50.58,33.79 50.67,33.88 50.67,34.2 50.58,34.29 50.51,34.29 50.42,34.38 50.42,34.7 50.51,34.79 50.58,34.79 50.67,34.88 50.67,35.2 50.58,35.29 50.51,35.29 50.42,35.38 50.42,35.7 50.51,35.79 50.58,35.79 50.67,35.88 50.67,36.19 48.64,38.23 48.64,38.55 49.27,39.19 49.27,39.77
DDR_A7: length 23
  Top Layer w0.127: v1(37.53,25.97) 37.94,26.39 U1.J15 ; v1(46.17,33.78) 46.17,34.98 46.27,35.08 46.27,35.4 46.17,35.5 46.17,35.53 46.06,35.64 46.06,36.2 U2.M2
  Bottom Layer w0.127: v1(37.53,25.97) 37.02,26.48 37.02,29.02 37.34,29.34 39.37,29.34 40.31,30.28 40.73,30.28 40.82,30.37 40.82,30.65 40.91,30.74 41.23,30.74 41.32,30.65 41.32,30.37 41.41,30.28 41.73,30.28 41.82,30.37 41.82,30.65 41.91,30.74 42.23,30.74 42.32,30.65 42.32,30.37 42.41,30.28 42.73,30.28 42.82,30.37 42.82,30.65 42.91,30.74 43.23,30.74 43.32,30.65 43.32,30.37 43.41,30.28 43.73,30.28 43.82,30.37 43.82,30.65 43.91,30.74 44.23,30.74 44.32,30.65 44.32,30.37 44.41,30.28 46.03,30.28 46.61,30.86 46.61,33.34 v1(46.17,33.78)
DDR_A8: length 23.3
  Top Layer w0.127: U1.H16 39.16,27.39 39.5,27.05 47.88,27.05 51.44,30.61 51.44,37.6 U2.N8
DDR_A9: length 22.4
  Top Layer w0.127: v1(46.1,40.26) 46.35,40 46.35,37.61 46.45,37.52 U2.M3 ; U1.E13 36.06,30.35 36.45,30.35 36.96,30.86 39.08,30.86 39.46,31.24 v1(40.77,31.24)
  Bottom Layer w0.127: v1(40.77,31.24) 43.43,31.24 43.94,31.75 45.09,31.75 45.72,32.38 45.72,34.67 46.48,35.43 46.48,39.88 v1(46.1,40.26)
DDR_A10: length 23.3
  Top Layer w0.127: U1.A13 35.69,34.73 35.69,35.53 35.56,35.66 35.56,37.34 v1(35.05,37.85) ; U2.H7 v1(46.45,42.04)
  Bottom Layer w0.127: v1(46.45,42.04) 45.81,42.67 45.21,42.67 44.96,42.93 44.02,42.93 43.76,42.67 43.18,42.67 42.55,42.04 41.61,42.04 41.1,41.53 40.23,41.53 40.14,41.44 40.14,40.6 40.05,40.51 39.73,40.51 39.64,40.6 39.64,41.44 39.55,41.53 38.48,41.53 38,41.05 38,40.92 38.46,40.47 38.46,40.34 38.23,40.12 38.1,40.12 37.65,40.57 37.52,40.57 37.3,40.34 37.3,40.22 37.75,39.76 37.75,39.64 37.52,39.41 37.39,39.41 36.94,39.86 36.81,39.86 36.59,39.64 36.59,39.51 36.69,39.4 36.69,39.28 36.47,39.05 36.25,39.05 v1(35.05,37.85)
DDR_A11: length 23.5
  Top Layer w0.127: U1.G15 38.6,28.96 39.98,28.96 40.24,28.7 42.2,28.7 42.46,28.96 46.2,28.96 46.99,29.75 47.11,29.75 47.26,29.6 47.38,29.6 47.61,29.83 47.61,29.96 47.47,30.1 47.47,30.23 47.69,30.45 47.82,30.45 47.96,30.31 48.09,30.31 48.32,30.54 48.32,30.66 48.17,30.81 48.17,30.93 48.4,31.16 48.53,31.16 48.67,31.02 48.8,31.02 49.02,31.24 49.02,31.37 48.88,31.51 48.88,31.64 49.11,31.87 49.23,31.87 49.38,31.72 49.5,31.72 49.73,31.95 49.73,32.08 49.59,32.22 49.59,32.35 49.78,32.54 49.78,36.19 48.13,37.85 48.13,38.62 U2.M7
DDR_A12: length 22.6
  Top Layer w0.127: U1.D16 39.24,31.39 39.61,31.75 41.24,31.75 42.16,30.82 42.16,30.35 42.55,29.97 45.97,29.97 46.99,30.99 46.99,32.64 48,33.65 48,33.78 47.81,33.97 47.81,34.1 48.04,34.32 48.17,34.32 48.36,34.13 48.48,34.13 48.71,34.36 48.71,34.49 48.52,34.68 48.52,34.8 48.75,35.03 48.87,35.03 49.06,34.84 49.19,34.84 49.53,35.18 49.53,35.56 49.4,35.69 49.4,35.74 49.14,36 49.09,36 47.04,38.05 47.04,39.79 47.58,40.33
DDR_A13: length 23.2
  Top Layer w0.127: v1(48.95,35.56) 47.82,35.56 U2.N3 ; U1.H14 37.47,26.95 v1(37.47,26.92)
  Bottom Layer w0.127: v1(37.47,26.92) 38.23,26.16 39.24,26.16 40.51,27.43 45.21,27.43 49.53,31.75 49.53,32.59 49.36,32.76 49.36,33.08 49.45,33.17 49.82,33.17 49.91,33.26 49.91,33.58 49.82,33.67 49.45,33.67 49.36,33.76 49.36,34.08 49.45,34.17 49.82,34.17 49.91,34.26 49.91,34.6 v1(48.95,35.56)
DDR_A14: length 23.6
  Top Layer w0.127: U1.G14 37.6,27.81 47.24,27.81 51.05,31.62 51.05,36.85 U2.N7
DDR_A15: length 23.2
  Top Layer w0.127: 39.75,32.39 U1.C16 ; U2.J7 46.61,40.49 46.61,37.72 46.86,37.46 46.86,36.78 46.62,36.53 46.62,36.21 47.5,35.33 47.5,34.42 46.86,33.78 46.86,33.15 46.13,32.41 46.13,32.16 45.85,31.88 45.85,30.86 45.72,30.73 45.47,30.73 45.21,30.99 45.21,31.71 45.18,31.75 44.83,31.75 44.58,31.5 44.58,30.61 44.45,30.48 44.07,30.48 43.88,30.67 43.88,31.43 43.69,31.62 43.31,31.62 43.05,31.37 43.05,30.61 42.93,30.48 42.8,30.48 42.55,30.73 42.55,31.4 41.78,32.16 39.98,32.16 39.75,32.38
DDR_BA0: length 22.9
  Top Layer w0.127: v1(34.48,28.89) 34.53,28.89 U1.F12
  Top Layer w0.254: U2.J2 44.2,38.06 v1(44.2,37.59)
  Bottom Layer w0.127: v1(44.2,37.59) 43.81,37.21 43.81,36.06 43.76,36 43.76,35.75 43.18,35.18 43.18,34.67 43.05,34.54 42.5,34.54 42.41,34.63 42.41,35.52 42.32,35.61 42,35.61 41.91,35.52 41.91,34.63 41.82,34.54 41.5,34.54 41.41,34.63 41.41,35.66 41.32,35.75 41,35.75 40.91,35.66 40.91,34.63 40.82,34.54 40.5,34.54 40.41,34.63 40.41,35.66 40.32,35.75 40,35.75 39.91,35.66 39.91,34.63 39.82,34.54 39.5,34.54 38.17,33.21 38.17,32.57 38.1,32.5 38.1,31.75 36.83,30.48 36.45,30.48 36,30.03 35.62,30.03 v1(34.48,28.89)
DDR_BA1: length 22.6
  Top Layer w0.127: v1(37.47,28.83) 37.47,28.95 U1.F14 ; U2.K8 v1(48.14,40.39)
  Bottom Layer w0.127: v1(48.14,40.39) 48.14,38.36 48.13,38.35 48.13,31.88 46.25,30 46,30 44.96,28.96 42.45,28.96 41.4,30 40.67,30 39.5,28.83 v1(37.47,28.83)
DDR_BA2: length 23.1
  Top Layer w0.127: U2.J3 44.75,39.58 v1(44.2,40.13) ; v1(36.42,30.95) 36.42,30.99 U1.D13
  Bottom Layer w0.127: v1(36.42,30.95) 36.79,30.95 37.13,31.29 37.13,31.42 37.08,31.47 37.08,31.59 37.3,31.82 37.43,31.82 37.48,31.77 37.61,31.77 37.85,32 37.85,33.29 37.85,33.29 37.86,33.29 37.92,33.35 37.92,33.48 37.61,33.79 37.61,33.92 37.84,34.14 37.96,34.14 38.28,33.83 38.4,33.83 38.61,34.03 38.61,34.16 37.92,34.85 37.92,34.97 38.15,35.2 38.28,35.2 38.96,34.52 39.09,34.52 39.5,34.92 39.5,35.76 39.91,36.18 39.91,36.53 40,36.62 40.33,36.62 40.41,36.53 40.41,36.18 40.5,36.09 41.52,36.09 41.79,36.36 41.79,36.49 41.15,37.12 41.15,37.25 41.38,37.48 41.5,37.48 42.14,36.84 42.27,36.84 42.29,36.86 42.29,37.72 42.61,38.04 42.61,38.38 42.32,38.66 42.32,38.79 42.55,39.01 42.68,39.01 42.77,38.92 42.89,38.92 43.12,39.15 43.12,39.28 43.03,39.37 43.03,39.49 43.67,40.13 v1(44.2,40.13)
DDR_CAL_PASS: length 16.2
  Top Layer w0.127: v1(51.05,22.1) 52.72,20.43 LED2.2 ; U1.M16 42.09,23.39 v1(42.67,22.8)
  Bottom Layer w0.127: v1(42.67,22.8) 50.35,22.8 v1(51.05,22.1)
DDR_CAS_N: length 23.7
  Top Layer w0.127: v1(43.43,41.4) 43.5,41.33 43.5,40.84 43.62,40.72 43.62,39.77 ; v1(34.54,30.86) 34.54,30.87 U1.D11
  Bottom Layer w0.127: v1(43.43,41.4) 43.31,41.4 42.8,40.89 41.15,40.89 40.92,40.67 40.92,40.1 41.4,39.62 41.4,38.99 40.91,38.5 40.78,38.5 40.54,38.74 40.42,38.74 40.19,38.51 40.19,38.39 40.43,38.14 40.43,38.02 40.2,37.79 40.08,37.79 39.84,38.03 39.71,38.03 39.48,37.81 39.48,37.68 39.72,37.44 39.72,37.31 39.24,36.83 37.68,36.83 37.59,36.92 37.59,37.16 37.5,37.25 37.18,37.25 37.09,37.16 37.09,36.92 37,36.83 36.68,36.83 36.59,36.92 36.59,37.16 36.5,37.25 36.18,37.25 36.09,37.16 36.09,36.92 36,36.83 35.73,36.83 35.51,36.61 35.51,34.25 35.31,34.04 35.31,32.38 34.04,31.11 34.04,30.99 34.16,30.86 v1(34.54,30.86)
DDR_CK_N: length 21.7
  Top Layer w0.156: U1.A15 38.03,35.59 37.96,35.65 37.96,35.81 38.1,35.94 38.5,35.94 38.61,35.83 38.61,35.16 38.72,35.05 39,35.05 39.11,35.16 39.11,35.83 39.22,35.94 40.26,35.94 40.89,35.31 40.89,33.78 41.46,33.22 42.49,33.22 42.94,33.67 42.94,34.19 42.61,34.52 42.12,34.52 42.01,34.63 42.01,34.81 42.12,34.92 42.44,34.92 43.24,35.72 v1(43.24,36.09) ; U2.G7 45.21,41.36 v1(45.21,41.27)
  Bottom Layer w0.156: 45.25,41.34 44.95,41.03 44.95,40.61 45.43,40.13 45.43,39.71 42.96,37.25 42.96,36.62 43.24,36.34 v1(43.24,36.09)
DDR_CK_P: length 21.8
  Top Layer w0.156: v1(42.38,36.09) 42.38,35.71 42.51,35.58 42.51,35.43 42.31,35.23 41.99,35.23 41.7,34.94 41.7,34.5 41.99,34.21 42.48,34.21 42.63,34.06 42.63,33.8 42.37,33.53 41.58,33.53 41.2,33.91 41.2,35.43 40.39,36.25 37.97,36.25 37.66,35.94 37.66,35.65 37.59,35.59 37.59,33.82 U1.B15 ; U2.F7 44.63,41.91 v1(44.58,41.91)
  Bottom Layer w0.156: v1(42.38,36.09) 42.38,36.34 42.66,36.62 42.66,37.38 45.12,39.84 45.12,40 44.5,40.62 44.5,41.83 v1(44.58,41.91)
DDR_CKE: length 23.7
  Top Layer w0.127: U1.C11 33.66,32.76 v1(33.66,32.89) ; U2.G9 v1(47.01,43.94)
  Bottom Layer w0.127: v1(33.66,32.89) 34.29,33.53 34.29,40.51 35.43,41.66 36.65,41.66 37.66,42.67 41.02,42.67 41.28,42.42 42.56,42.42 43.96,43.81 44.01,43.81 44.01,43.81 44.38,43.81 44.39,43.81 46.88,43.81 v1(47.01,43.94)
DDR_CS_N: length 22.1
  Top Layer w0.127: U2.H2 43.05,38.63 42.26,37.85 42.19,37.85 42.1,37.76 42.1,36.96 42.01,36.87 41.69,36.87 41.6,36.96 41.6,37.76 41.51,37.85 41.19,37.85 41.1,37.76 41.1,36.96 41.01,36.87 40.69,36.87 40.6,36.96 40.6,37.76 40.51,37.85 40,37.85 39.93,37.92 39.81,37.92 39.61,37.72 39.48,37.72 39.25,37.95 39.25,38.07 39.45,38.27 39.45,38.4 39.24,38.61 38.9,38.61 38.81,38.52 38.81,37.8 38.72,37.71 38.49,37.71 38.4,37.8 38.4,38.43 38.22,38.61 37.72,38.61 37.25,39.08 36.79,39.08 36.7,38.99 36.7,38.48 37.03,38.15 37.03,37.76 37.12,37.67 37.26,37.67 37.35,37.58 37.35,37.26 37.26,37.17 37.12,37.17 37.03,37.08 37.03,37.03 36.58,36.58 36.58,35.65 36.49,35.56 36.07,35.56 35.98,35.47 35.98,35.15 36.07,35.06 36.49,35.06 36.58,34.97 36.58,32.93 U1.C13
DDR_DM: length 24.6
  Top Layer w0.127: U2.B7 v1(43.05,45.34) ; U1.D8 31.03,31.41 v1(31.5,31.88)
  Bottom Layer w0.127: v1(31.5,31.88) 31.12,32.26 31.12,33.02 31.5,33.4 31.5,35.94 32.38,36.83 32.38,37.85 32.19,38.04 32.19,41.59 36.58,45.97 42.42,45.97 v1(43.05,45.34)
DDR_DQ0: length 23.6
  Top Layer w0.127: v1(40.26,44.07) 40.79,43.54 40.79,42.59 ; v1(36.32,43.05) 34.44,43.05 32.13,40.74 32.13,38.48 32.94,37.67 32.94,36.81 32.51,36.38 32.51,35.69 33.53,34.67 33.53,33.89 U1.B10
  Bottom Layer w0.127: v1(40.26,44.07) 40.7,43.62 40.7,43.5 40.51,43.31 39.75,43.31 39.37,43.69 39.37,44.07 38.99,44.45 37.97,44.45 37.21,43.69 37.21,42.8 36.72,42.31 ; v1(36.32,43.05) 36.12,42.86 36.12,42.52 36.33,42.31 36.72,42.31 ; 36.72,42.31 36.74,42.31
DDR_DQ1: length 23.3
  Top Layer w0.127: U2.C7 43.4,44.07 41.91,44.07 40.64,45.34 37.59,45.34 35.82,43.57 34.2,43.57 31.5,40.86 31.5,32.85 U1.C8
DDR_DQ2: length 23.2
  Top Layer w0.127: 40.79,41.46 40.61,41.29 40.06,41.29 39.8,41.02 38.99,41.02 37.97,42.04 36.07,42.04 35.36,41.33 35.24,41.33 34.95,41.62 34.82,41.62 34.59,41.39 34.59,41.27 34.88,40.98 34.88,40.85 34.66,40.62 34.53,40.62 34.24,40.91 34.11,40.91 33.89,40.69 33.89,40.56 34.18,40.27 34.18,40.14 33.95,39.92 33.82,39.92 33.53,40.21 33.41,40.21 33.18,39.98 33.18,39.85 33.47,39.56 33.47,39.44 33.27,39.24 v1(33.02,39.24) ; U1.C9 32.13,32.39 v1(32.64,32.89)
  Bottom Layer w0.127: v1(32.64,32.89) 32,32.26 31.88,32.26 31.69,32.45 31.69,32.96 32,33.27 32,35.43 32.47,35.9 32.47,36.28 32.97,36.78 32.97,37.11 32.64,37.44 32.64,37.64 32.78,37.78 33.07,37.78 33.16,37.87 33.16,38.19 33.07,38.28 32.56,38.28 32.47,38.37 32.47,38.69 v1(33.02,39.24)
DDR_DQ3: length 23.9
  Top Layer w0.127: U2.C8 43.63,44.86 43.22,44.45 42.04,44.45 40.64,45.85 37.21,45.85 35.71,44.35 34.02,44.35 31.03,41.36 31.03,37.62 30.94,37.53 30.82,37.53 30.73,37.44 30.73,37.12 30.82,37.03 30.94,37.03 31.03,36.94 31.03,36.62 30.94,36.53 30.82,36.53 30.73,36.44 30.73,36.12 30.82,36.03 30.94,36.03 31.03,35.94 31.03,35.62 30.94,35.53 30.82,35.53 30.73,35.44 30.73,35.12 30.82,35.03 30.94,35.03 31.03,34.94 U1.A8
DDR_DQ4: length 24.2
  Top Layer w0.127: U2.E3 42.49,41.45 42.7,41.67 42.7,42.07 43.05,42.42 43.05,43.43 42.8,43.69 41.78,43.69 40.51,44.96 38.32,44.96 36.92,43.56 36.92,42.51 36.83,42.42 35.05,42.42 32.51,39.88 32.51,38.75 33.27,37.99 33.27,36.43 34.54,35.16 34.54,33.9 U1.B11
DDR_DQ5: length 24
  Top Layer w0.127: v1(45.33,44.31) 45.33,43.74 U2.E8 ; v1(31.94,37.46) 31.94,34.48 U1.A9
  Bottom Layer w0.127: v1(31.94,37.46) 31.94,41.72 36.44,46.23 43.43,46.23 45.33,44.33 v1(45.33,44.31)
DDR_DQ6: length 23.2
  Top Layer w0.127: U2.D2 40.8,40.9 39.91,40 39.61,40 39.52,39.91 39.52,39.84 39.43,39.75 39.11,39.75 39.02,39.84 39.02,39.91 38.93,40 38.35,40 38.11,40.25 37.98,40.25 37.78,40.04 37.65,40.04 37.43,40.27 37.43,40.4 37.63,40.6 37.63,40.73 37.4,40.95 37.28,40.95 36.8,40.47 36.67,40.47 36.44,40.7 36.44,40.83 36.92,41.31 36.92,41.44 36.7,41.66 36.19,41.66 35.97,41.44 35.97,41.31 36.1,41.18 36.1,41.05 35.88,40.83 35.75,40.83 35.62,40.95 35.49,40.95 35.27,40.73 35.27,40.6 35.4,40.47 35.4,40.34 35.17,40.12 35.04,40.12 34.91,40.25 34.79,40.25 34.56,40.02 34.56,39.89 34.69,39.77 34.69,39.64 34.46,39.41 34.34,39.41 34.21,39.54 34.08,39.54 33.91,39.37 33.91,38.48 34,38.39 34.51,38.39 34.6,38.3 34.6,37.98 34.51,37.89 34,37.89 33.91,37.8 33.91,37.48 34,37.39 34.51,37.39 34.6,37.3 34.6,36.98 34.51,36.89 34,36.89 33.91,36.8 33.91,36.51 34.26,36.16 34.39,36.16 34.92,36.68 35.04,36.68 35.27,36.46 35.27,36.33 34.74,35.8 34.74,35.68 35.03,35.39 35.03,35.29 35.12,35.2 35.19,35.2 35.28,35.11 35.28,34.79 35.19,34.7 35.12,34.7 35.03,34.61 U1.A12
DDR_DQ7: length 23.8
  Top Layer w0.127: v1(40.78,42.04) 40.79,42.04 42.32,40.51 42.65,40.51 42.65,40.51 42.67,40.51 42.93,40.77 42.93,41.53 44.07,42.67 44.26,42.67 U2.E7 ; v1(34.54,32.89) 34.54,32.9 U1.B12
  Bottom Layer w0.127: v1(40.78,42.04) 38.35,42.04 37.35,41.03 37.22,41.03 36.91,41.34 36.78,41.34 36.56,41.12 36.56,40.99 36.87,40.68 36.87,40.55 36.64,40.33 36.51,40.33 36.21,40.63 36.08,40.63 35.85,40.41 35.85,40.28 36.16,39.97 36.16,39.85 35.93,39.62 35.81,39.62 35.5,39.93 35.37,39.93 35.14,39.7 35.14,39.57 35.45,39.27 35.45,39.14 35.23,38.91 35.1,38.91 34.9,39.11 34.77,39.11 34.54,38.89 34.54,38.76 34.75,38.56 34.75,38.43 34.54,38.23 v1(34.54,32.89)
DDR_DQS_N: length 23.8
  Top Layer w0.156: v1(32.53,34.95) 33.03,34.45 U1.A10 ; v1(42.29,42.93) 42.29,41.83 U2.D3
  Bottom Layer w0.156: v1(42.29,42.93) 42.29,43.26 42.38,43.35 42.38,44.87 41.56,45.69 36.75,45.69 33.53,42.47 33.53,34.88 33.2,34.55 32.92,34.55 v1(32.53,34.95)
DDR_DQS_P: length 23.8
  Top Layer w0.156: v1(41.61,43.02) 41.61,42.29 U2.C3 ; U1.B9 32.49,33.85 v1(32.51,33.85)
  Bottom Layer w0.156: v1(41.61,43.02) 42.07,43.48 42.07,43.68 41.96,43.79 41.52,43.79 41.41,43.9 41.41,44.18 41.52,44.29 41.96,44.29 42.07,44.4 42.07,44.74 41.43,45.38 36.88,45.38 33.84,42.34 33.84,34.75 33.33,34.25 32.91,34.25 v1(32.51,33.85)
DDR_ODT: length 23.5
  Top Layer w0.127: v1(36.13,36.07) 36.13,36.83 36.7,37.41 36.7,37.95 35.66,38.99 35.66,39.34 35.94,39.62 36.19,39.62 36.45,39.37 37.72,39.37 37.97,39.12 39.12,39.12 39.88,38.35 40,38.35 40.16,38.2 42.06,38.2 U2.G1 ; 35.08,32.39 34.61,31.92 v1(33.53,31.92)
  Bottom Layer w0.127: v1(33.53,31.92) 33.02,31.41 33.02,30.61 33.4,30.23 34.04,30.23 34.16,30.35 34.8,30.35 35.05,30.61 35.05,30.73 35.92,31.61 36.1,31.61 36.45,31.96 36.45,34.67 36.13,34.99 v1(36.13,36.07)
DDR_RAS_N: length 22.1
  Top Layer w0.127: U2.F3 43.05,39.78 41.88,38.61 40.26,38.61 39.37,39.5 38.1,39.5 37.81,39.79 36.67,39.79 36.58,39.88 36.58,40.13 36.41,40.3 36.23,40.3 36.05,40.11 35.92,40.11 35.81,40.22 35.69,40.22 35.46,40 35.46,39.87 35.57,39.76 35.57,39.63 35.5,39.57 35.32,39.57 35.27,39.62 35.09,39.62 34.96,39.49 34.96,39.37 35.07,39.26 35.07,39.13 34.82,38.89 34.82,38.71 35.05,38.48 35.31,38.48 v1(35.94,37.85) ; v1(33.53,30.73) 33.68,30.73 U1.E11
  Bottom Layer w0.127: v1(33.53,30.73) 33.53,30.99 34.54,32 34.54,32.13 35.05,32.64 35.05,33.17 34.93,33.3 34.93,36.83 v1(35.94,37.85)
DDR_RST_N: length 33.8
  Top Layer w0.127: U1.J16 39.53,26.39 v1(39.88,26.03) ; 46.45,35.81 46.86,35.39 v1(46.86,34.92)
  Bottom Layer w0.127: v1(46.86,34.92) 46.86,40.64 47.5,41.27 48.81,41.27 49.19,40.9 49.19,36.41 50.42,35.18 50.42,30.99 46.35,26.92 41.41,26.92 41.22,26.74 R47.2 40.97,26.03 v1(39.88,26.03)
DDR_VREF: length 64.4
  Top Layer w0.127: 41.35,39.77 40.83,39.24 v1(40.77,39.24) ; U2.J8 48.13,41.46 48.53,41.87 48.53,41.87 48.84,42.17 48.84,42.22 48.85,42.23 48.85,42.97 C7.2
  Top Layer w0.254: v1(31.5,30.86) 31.5,30.86 U1.D9
  Bottom Layer w0.127: C8.2 39.88,38.87 40.13,39.12 40.64,39.12 v1(40.77,39.24) 40.77,39.9 40.67,40 40.67,40.77 41.04,41.15 41.53,41.15 41.78,41.4 42.67,41.4 43.18,41.91 43.56,41.91 44.2,42.55 44.78,42.55 44.91,42.42 45.21,42.42 46.23,41.4 46.86,41.4 49.02,43.56 v1(49.53,43.56)
  Bottom Layer w0.254: R41.1 R42.2 ; R42.2 51.37,38.81 C92.2 C93.1 ; R42.2 50.52,38.76 49.91,39.37 49.91,43.18 v1(49.53,43.56) 49.53,44.81 48.35,45.99 45.63,45.99 44.47,47.14 35.57,47.14 31.07,42.65 31.07,38.2 30.48,37.61 30.48,34.49 30.1,34.12 30.1,33.7 30.48,33.32 30.48,31.88 v1(31.5,30.86)
DDR_WE_N: length 22.2
  Top Layer w0.127: U1.C14 37.31,32.67 v1(37.31,32.87) ; 37.16,35.89 v1(37.08,35.81) 37.08,36.32 37.34,36.58 37.63,36.58 37.72,36.67 37.72,37.6 37.41,37.91 37.41,38.17 37.54,38.31 37.79,38.31 37.99,38.11 37.99,37.7 38.31,37.38 38.31,36.67 38.4,36.58 38.72,36.58 38.81,36.67 38.81,37.38 38.9,37.47 39.22,37.47 39.31,37.38 39.31,36.67 39.4,36.58 39.72,36.58 39.81,36.67 39.81,37.38 39.9,37.47 40.22,37.47 40.31,37.38 40.31,36.67 40.4,36.58 41.14,36.58 41.23,36.49 41.23,35.84 41.32,35.75 41.64,35.75 41.73,35.84 41.73,36.49 41.82,36.58 42.11,36.58 42.31,36.78 42.44,36.78 42.71,36.51 42.84,36.51 43.06,36.74 43.06,36.86 42.79,37.13 42.79,37.26 44.01,38.47 44.01,38.8 43.95,38.85 43.95,38.97 U2.H3 ; 37.16,35.87 37.21,35.81
  Bottom Layer w0.127: v1(37.31,32.87) 37.31,34.16 37.22,34.25 37.15,34.25 37.06,34.34 37.06,34.66 37.15,34.75 37.22,34.75 37.31,34.84 37.31,35.21 37.08,35.43 v1(37.08,35.81)
DONE: length 27.2
  Top Layer w0.127: v1(50.16,24.13) 52.55,24.13 R20.1 54.08,25.66 LED1.2 ; v1(34.54,27.81) 34.54,27.18 34.29,26.92 33.49,26.92 U1.H10
  Bottom Layer w0.127: v1(50.16,24.13) 49.02,25.27 47.62,25.27 46.48,24.13 46.33,24.13 45.7,23.49 36.77,23.49 36.14,24.13 35.94,24.13 35.43,24.64 35.43,26.42 34.54,27.3 v1(34.54,27.81)
FPGA_CLK: length 5.5
  Top Layer w0.127: X1.3 41.8,21.96 41.01,22.75 39.19,22.75 39.18,22.76 37.4,22.76 U1.N14
GPIO0_1V8: length 14.8
  Top Layer w0.127: v1(3.56,20.32) 2.92,20.32 2.54,19.94 2.54,16.76 3.3,16 7.24,16 9.62,13.62 U8.2
GPIO0_3V3: length 16.3
  Top Layer w0.127: U1.T7 30.16,19.26 30.16,17.96 29.59,17.4 27.69,17.4 26.67,16.38 20.96,16.38 18.45,13.87 18.45,13.86 18.07,13.49 17.41,13.49 U8.13
GPIO1_1V8: length 16.9
  Top Layer w0.127: U8.3 9.38,12.97 6.86,15.49 2.79,15.49 2.16,16.13 2.16,20.57 2.67,21.08 v1(3.56,21.08)
GPIO1_3V3: length 17.1
  Top Layer w0.127: U1.T8 31.03,18.2 29.72,16.89 28.07,16.89 27.05,15.88 21.08,15.88 18.18,12.97 U8.12
GPIO2_1V8: length 19.7
  Top Layer w0.127: U8.4 9.27,12.32 6.6,14.99 2.54,14.99 1.65,15.88 1.65,21.84 2.54,22.73 v1(3.56,22.73)
GPIO2_3V3: length 18.2
  Top Layer w0.127: U1.T9 32,19.36 32,18.54 29.59,16.13 28.45,16.13 27.69,15.37 21.72,15.37 18.67,12.32 U8.11
GPIO3_1V8: length 21.9
  Top Layer w0.127: v1(3.43,23.49) 2.16,23.49 1.02,22.35 1.02,15.62 2.03,14.6 6.22,14.6 9.16,11.67 U8.5
GPIO3_3V3: length 19.5
  Top Layer w0.127: U8.10 18.91,11.67 21.97,14.73 29.34,14.73 33.03,18.42 U1.T10
H_SYNC: length 27.7
  Top Layer w0.127: U1.A4 26.54,34.87 26.54,35.69 25.65,36.58 22.22,36.58 19.05,33.4 13.08,33.4 10.29,36.19 7.37,36.19 6.62,35.45 v1(3.52,35.45)
LVDS_CLK_N: length 22.4
  Top Layer w0.156: U1.C4 26.54,31.9 v1(26.54,31.88)
  Bottom Layer w0.156: v1(26.54,31.88) 26.19,31.52 25.4,31.52 25.11,31.23 25.11,29.97 23.97,28.83 17.29,28.83 17,28.54 17,28.38 16.89,28.27 16.71,28.27 16.6,28.38 16.6,28.54 16.31,28.83 14.48,28.83 13.65,28 9.32,28 9.07,28.25 CN1.28
  vias: v1(7.88,28.27)
LVDS_CLK_P: length 22.5
  Top Layer w0.156: U1.D4 26.54,30.9 v1(26.54,30.86)
  Bottom Layer w0.156: CN1.30 9.07,27.45 9.32,27.7 13.78,27.7 14.61,28.52 16.18,28.52 16.29,28.41 16.29,28.25 16.59,27.96 17.02,27.96 17.31,28.25 17.31,28.41 17.42,28.52 24.09,28.52 25.42,29.84 25.42,31.1 25.53,31.21 26.19,31.21 v1(26.54,30.86)
  vias: v1(7.88,27.45)
LVDS_D0_N: length 22.1
  Top Layer w0.156: v1(24.51,34.92) 24.51,34.9 U1.A2
  Bottom Layer w0.156: CN1.4 9.07,37.85 9.32,37.6 10.84,37.6 11.66,36.78 11.82,36.78 12.08,37.04 12.49,37.04 12.8,36.73 12.8,36.32 12.54,36.06 12.54,35.9 12.66,35.78 12.82,35.78 13.08,36.04 13.49,36.04 13.8,35.73 13.8,35.32 13.54,35.06 13.54,34.9 15.2,33.24 18.83,33.24 20.1,34.51 24.09,34.51 v1(24.51,34.92)
  vias: v1(7.93,37.87)
LVDS_D0_P: length 22
  Top Layer w0.156: U1.B2 24.63,33.78 v1(24.51,33.78)
  Bottom Layer w0.156: v1(24.51,33.78) 24.09,34.2 20.23,34.2 18.96,32.93 15.08,32.93 13.23,34.78 13.23,35.19 13.49,35.45 13.49,35.6 13.36,35.73 13.21,35.73 12.95,35.47 12.54,35.47 12.23,35.78 12.23,36.19 12.49,36.45 12.49,36.6 12.36,36.73 12.21,36.73 11.95,36.47 11.53,36.47 10.71,37.3 9.32,37.3 9.07,37.05 CN1.6
  vias: v1(7.9,37.07)
